# Altium schematic sheet FPGA_CFG.SchDoc
size A4; SheetNumber: 5; SheetTotal: 8
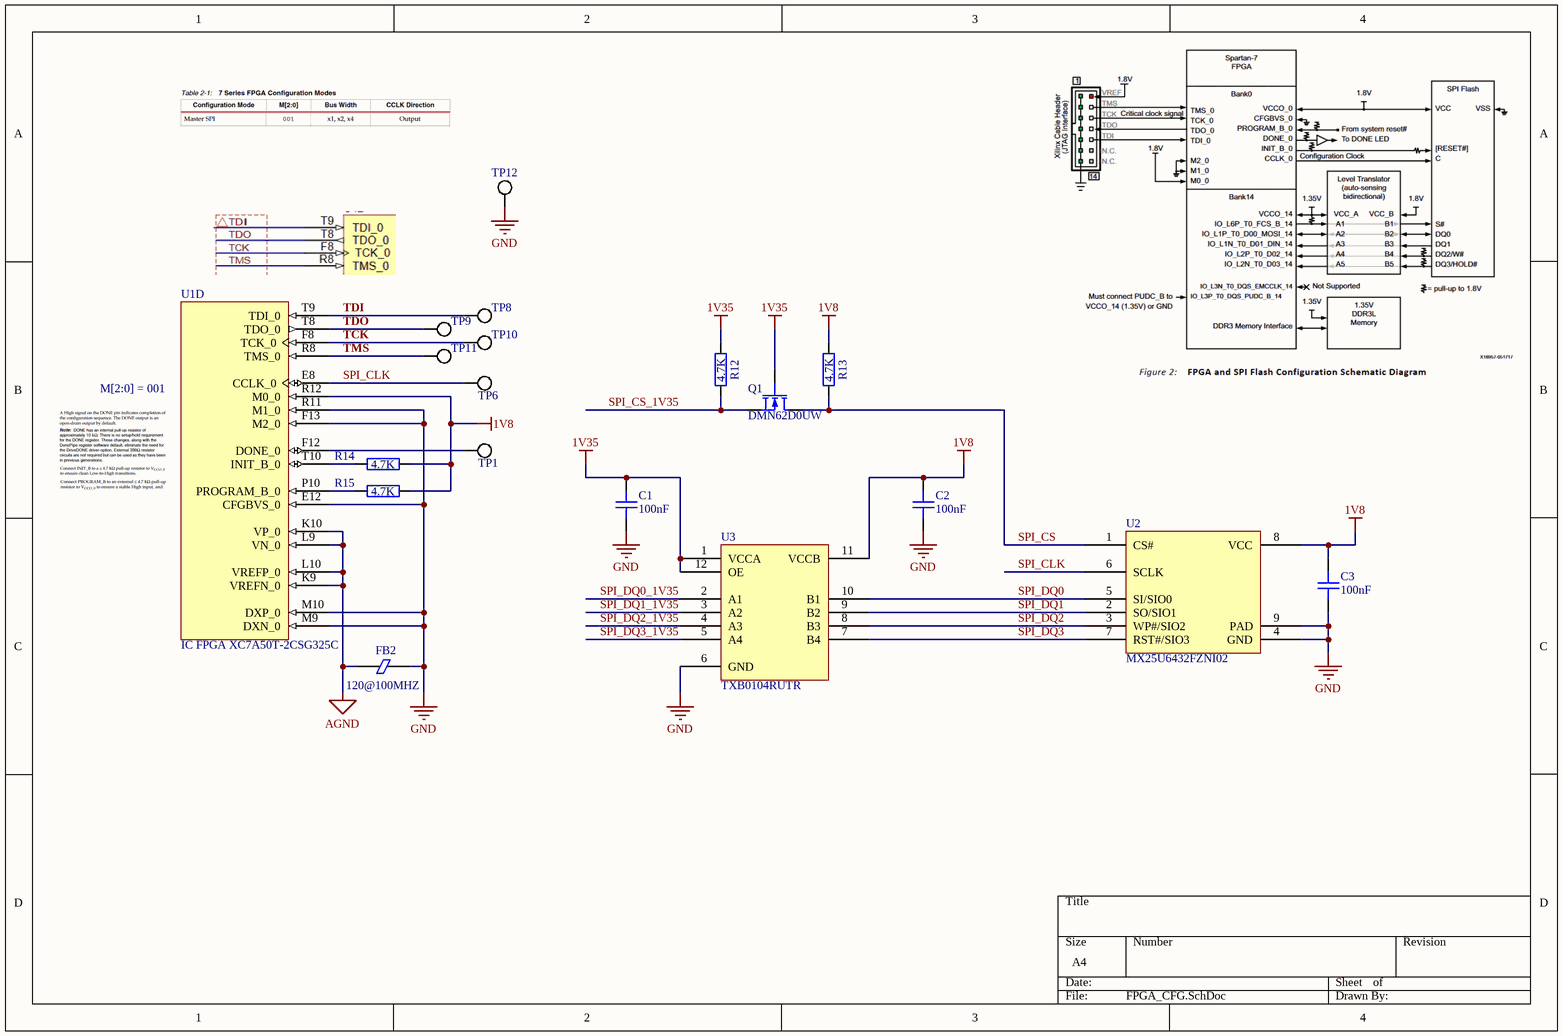
[diagram p0: FPGA_CFG.SchDoc]

## Parts
C1  100nF  [GEN_C_0402]
C2  100nF  [GEN_C_0402]
C3  100nF  [GEN_C_0402]
FB2  120@100MHZ  [GEN_R_0402]
Q1  DMN62D0UW  [GEN_SOT_323]
R12  4.7K  [GEN_R_0201]
R13  4.7K  [GEN_R_0201]
R14  4.7K  [GEN_R_0201]
R15  4.7K  [GEN_R_0201]
TP1  PCB  [GEN_TP_PCB]  (value not drawn)  (no BOM)
TP6  PCB  [GEN_TP_PCB]  (value not drawn)  (no BOM)
TP8  PCB  [GEN_TP_PCB]  (value not drawn)  (no BOM)
TP9  PCB  [GEN_TP_PCB]  (value not drawn)  (no BOM)
TP10  PCB  [GEN_TP_PCB]  (value not drawn)  (no BOM)
TP11  PCB  [GEN_TP_PCB]  (value not drawn)  (no BOM)
TP12  PCB  [GEN_TP_PCB]  (value not drawn)  (no BOM)
U1  IC FPGA XC7A50T-2CSG325C  [XILINX_XC7A50T-2CSG325C]  (part D of 9)
U2  MX25U6432FZNI02  [MX_WSON8]
U3  TXB0104RUTR  [TI_UQFN_RUT0012A]

## Nets
1V8: C2.1 C3.1 R13.2 R14.2 R15.2 U1.R12(M0_0) U2.8(VCC) U3.11(VCCB)
1V35: C1.1 Q1.2(G) R12.2 U3.1(VCCA) U3.12(OE)
AGND: FB2.1 U1.K9(VREFN_0) U1.K10(VP_0) U1.L9(VN_0) U1.L10(VREFP_0)
GND: C1.2 C2.2 C3.2 FB2.2 TP12.1 U1.E12(CFGBVS_0) U1.F13(M2_0) U1.M9(DXN_0) U1.M10(DXP_0) U1.R11(M1_0) U2.4(GND) U2.9(PAD) U3.6(GND)
SPI_CLK: TP6.1 U1.E8(CCLK_0) U2.6(SCLK)
SPI_CS: Q1.1(D) R13.1 U2.1(CS#)
SPI_CS_1V35: Q1.3(S) R12.1
SPI_DQ0: U2.5(SI/SIO0) U3.10(B1)
SPI_DQ0_1V35: U3.2(A1)
SPI_DQ1: U2.2(SO/SIO1) U3.9(B2)
SPI_DQ1_1V35: U3.3(A2)
SPI_DQ2: U2.3(WP#/SIO2) U3.8(B3)
SPI_DQ2_1V35: U3.4(A3)
SPI_DQ3: U2.7(RST#/SIO3) U3.7(B4)
SPI_DQ3_1V35: U3.5(A4)
TCK: TP10.1 U1.F8(TCK_0)
TDI: TP8.1 U1.T9(TDI_0)
TDO: TP9.1 U1.T8(TDO_0)
TMS: TP11.1 U1.R8(TMS_0)
NetR14_1: R14.1 U1.T10(INIT_B_0)
NetR15_1: R15.1 U1.P10(PROGRAM_B_0)
NetTP1_1: TP1.1 U1.F12(DONE_0)

## Notes on the sheet
- M[2:0] = 001

## Library data of the parts
C1-C3 = CAP 100nF 16V X7R 0402: Voltage Rating: 16V; Package: 0402; Supplier 1: Digi-Key; Supplier Part Number 1: 490-4759-1-ND; Value: 100nF
FB2 = FERRITE BEAD 120 OHM 0402: Supplier 1: Digi-Key; Supplier Part Number 1: 490-9656-1-ND
Q1 = NMOS DMN62D0UW: Vdss: 60V; Id: 340mA; Max Power: 320mW; Supplier 1: Digi-Key; Supplier Part Number 1: DMN62D0UW-7DICT-ND
R12-R15 = RES 4.7K OHM 1% 1/20W 0201: Tolerance: 1%; Power Rating: 0.05W; Package: 0201; Supplier 1: Digi-Key; Supplier Part Number 1: 311-4.70KMTR-ND; Value: 4.7K
TP1 TP6 TP8-TP12 = TP PCB 1mm
U1 = IC FPGA XC7A50T-2CSG325C: Artix-7 FPGA, 150 User I/Os, 4 GTP, 324-Ball BGA, Speed Grade 2, Commercial Grade, Pb-Free; Manufacturer: Xilinx; Total Block RAM: 1800 Kb; GTP: 4; Clock Mgmt Tiles (CMTs): 5; Logic Cells: 33280; Available User I/O: 150; Speed Grades: 2; NexusDeviceID: XC7A35T-2CSG325C; DatasheetVersion: v1.15; PackageVersion: Rev. 1.11; PackageReference: CSG-325; PackageDescription: 324-Ball Wire-Bond Chip-Scale BGA, Body 15 x 15 mm, Pitch 0.8 mm; Maximum Distributed RAM: 400 Kb; Operating Temperature Range: Commercial; Mounting Technology: Surface Mount; PartNumber: XC7A35T-2CSG325C; ComponentLink1Description: Manufacturer URL; ComponentLink1URL: http://www.xilinx.com/; ComponentLink2Description: Datasheet; ComponentLink2URL: http://www.xilinx.com/support/documentation/data_sheets/ds180_7Series_Overview.pdf; ComponentLink3Description: Package Specification; ComponentLink3URL: http://www.xilinx.com/support/documentation/user_guides/ug475_7Series_Pkg_Pinout.pdf; ComponentLink4Description: DC and Switching Characteristics; ComponentLink4URL: http://www.xilinx.com/support/documentation/data_sheets/ds181_Artix_7_Data_Sheet.pdf; ComponentLink5Description: Package File; ComponentLink5URL: http://www.xilinx.com/support/packagefiles/a7packages/xc7a200tsbg484pkg.txt; ComponentLink6Description: Packaging and Pinout; ComponentLink6URL: http://www.xilinx.com/support/documentation/user_guides/ug475_7Series_Pkg_Pinout.pdf
U2 = IC FLASH MX25U6432FZNI02: Supplier 1: Digi-Key; Supplier Part Number 1: 1092-MX25U6432FZNI02-ND
U3 = IC TRNSLTR TXB0104RUTR: Supplier 1: Digi-Key; Supplier Part Number 1: 296-25888-1-ND